# Altium schematic sheet SatelliteDevBoard.SchDoc: SatelliteDevBoard
size 273 x 204 mm; Origin: Eagle; OriginPath: C:\Users\New User\OneDrive - Georgia Institute of Technology\Documents\iridium-satellite-comm\SatelliteDevBoard.sch; OriginSheet: 1; Date: 10/23/2025 6:23:18 PM; SheetNumber: 1; GateName_1: G$1; SymbolName_1: LETTER_L; LibraryName: frames; DeviceSetName: LETTER_L; GateName_2: G$2; SymbolName_2: DOCFIELD; Sheet: Sheet:; REV: REV:
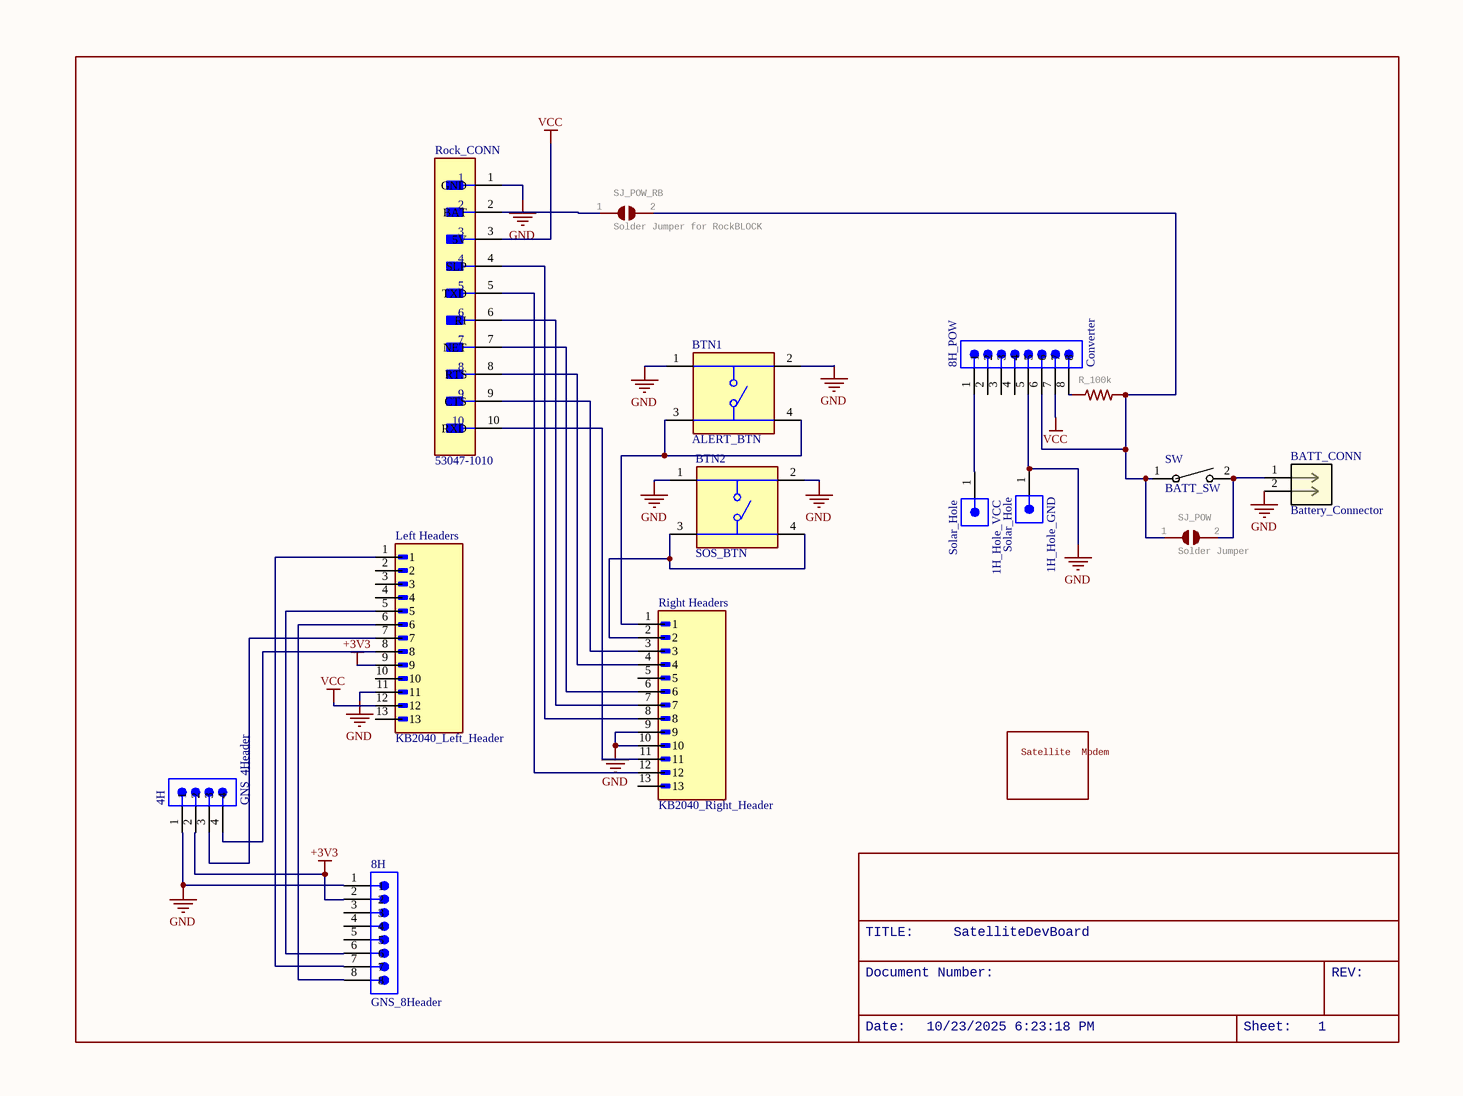
[diagram p0: SatelliteDevBoard.SchDoc]

## Parts
1H_Hole_GND  Solar_Hole  [61300111121]
1H_Hole_VCC  Solar_Hole  [61300111121]
4H  GNS_4Header  [61300411121]
8H  GNS_8Header  [61300811121]
8H_POW  Converter  [61300811121]
BATT_CONN  Battery_Connector  [CONN_S2B-PH-K-S_JST]
BTN1  ALERT_BTN  [SW_TS02-66-43-BK-260-LCR-D]
BTN2  SOS_BTN  [SW_TS02-66-43-BK-260-LCR-D]
Left_Headers  KB2040_Left_Header  [HARWIN_M20-9991346]
R_100k  (no value)  [0805-THM]
Right_Headers  KB2040_Right_Header  [HARWIN_M20-9991346]
Rock_CONN  53047-1010  [FP-53047-1010-MFG]
SJ_POW  Solder Jumper  [SOLDERJUMPER_ARROW_NOPASTE]
SJ_POW_RB  Solder Jumper for RockBLOCK  [SOLDERJUMPER_ARROW_NOPASTE]
SW  BATT_SW  [SW2_GF-123-0054_CWI]
U$1  Satellite
Modem: Satellite / Modem  [ROCKBLOCK-9603]  (hidden comment: ROCKBLOCK-9603)

## Nets
+3V3: 4H.2 8H.2 Left_Headers.9
GND: 1H_Hole_GND.1 4H.1 8H.1 8H_POW.5 BATT_CONN.2 BTN1.1 BTN1.2 BTN2.1 BTN2.2 Left_Headers.11 Right_Headers.9 Right_Headers.10 Rock_CONN.1(GND)
VCC: 8H_POW.7 Left_Headers.12 Rock_CONN.3(5V)
Net1H_Hole_VCC_1: 1H_Hole_VCC.1 8H_POW.1
Net4H_3: 4H.3 Left_Headers.7
Net4H_4: 4H.4 Left_Headers.8
Net8H_6: 8H.6 Left_Headers.5
Net8H_7: 8H.7 Left_Headers.1
Net8H_8: 8H.8 Left_Headers.6
Net8H_POW_6: 8H_POW.6 R_100k.2 SJ_POW.1 SJ_POW_RB.2 SW.1
Net8H_POW_8: 8H_POW.8 R_100k.1
NetBATT_CONN_1: BATT_CONN.1 SJ_POW.2 SW.2
NetBTN1_3: BTN1.3 BTN1.4 Right_Headers.1
NetBTN2_3: BTN2.3 BTN2.4 Right_Headers.2
NetRight_Headers_3: Right_Headers.3 Rock_CONN.9(CTS)
NetRight_Headers_4: Right_Headers.4 Rock_CONN.8(RTS)
NetRight_Headers_6: Right_Headers.6 Rock_CONN.7(NET)
NetRight_Headers_7: Right_Headers.7 Rock_CONN.6(RI)
NetRight_Headers_8: Right_Headers.8 Rock_CONN.4(SLP)
NetRight_Headers_11: Right_Headers.11 Rock_CONN.10(RXD)
NetRight_Headers_12: Right_Headers.12 Rock_CONN.5(TXD)
NetRock_CONN_2: Rock_CONN.2(BAT) SJ_POW_RB.1

Not connected (* = marked no-connect by the designer): 8H 3 4 5; 8H_POW 2 3 4; Left_Headers 2 3 4 10 13; Right_Headers 5 13

## Notes on the sheet
- TITLE:
- Document Number:
- SatelliteDevBoard
- REV:
- Date:
- 10/23/2025 6:23:18 PM
- Sheet:
- 1

## Library data of the parts
1H_Hole_GND 1H_Hole_VCC = CMP-1502-01058-4: THT Vertical Pin Header WR-PHD, Pitch 2.54 mm, Single Row, 1 pins; Gender: Male; Contact Resistance: 20mΩ; Current Rating: 3A; Number of Contacts: 1; Connector Type: Male Pin; Operating Supply Voltage: 250V; Termination: Solder; Mount: Through Hole; Orientation: Vertical; Contact Material: Copper; Number of Positions: 1; Color: Black; Packaging: Bulk; Contact Plating: Gold; Number of Pins: 1; Contact Mating Length: 5.9944mm; RoHS: Compliant; Number of Rows: 1; Lead Pitch: 2.54mm
4H = CMP-1502-01064-4: THT Vertical Pin Header WR-PHD, Pitch 2.54 mm, Single Row, 4 pins; Connector Type: Male Pin; Gender: Male; Current Rating: 3A; Number of Positions: 4; Operating Supply Voltage: 250V; Contact Resistance: 20mΩ; Pitch: 2.54mm; Max Operating Temperature: 105°C; Mount: Through Hole; Contact Material: Gold; Contact Plating: Gold; Number of Contacts: 4; Orientation: Vertical; Packaging: Bulk; Contact Mating Length: 5.9944mm; Voltage Rating: 250V; Number of Rows: 1; Height: 8.89mm; Lead Free: Lead Free; Lead Pitch: 2.54mm; Number of Pins: 4; Color: Black; Min Operating Temperature: -40°C; RoHS: Compliant; Termination: Solder
8H 8H_POW = CMP-1502-01076-4: THT Vertical Pin Header WR-PHD, Pitch 2.54 mm, Single Row, 8 pins; Pitch: 2.54mm; Voltage Rating: 250V; Connector Type: Male Pin; Current Rating: 3A; Contact Resistance: 20mΩ; Number of Positions: 8; Gender: Male; Contact Mating Length: 5.9944mm; Orientation: Vertical; Contact Plating: Gold; Mount: Through Hole; Min Operating Temperature: -40°C; Packaging: Bulk; Height: 8.54mm; Number of Pins: 8; Contact Material: Gold; Operating Supply Voltage: 250V; Termination: Solder; RoHS: Compliant; Color: Black; Number of Contacts: 8; Lead Pitch: 2.54mm; Number of Rows: 1; Max Operating Temperature: 105°C
BATT_CONN = S2B-PH-K-SLFSN: CONNECTOR; MALE; THROUGH HOLE; 2.0MM PITCH; DISCONNECTABLE CRIMP STYLE CONNECTOR; SIDE ENTRY TYPE; RIGHT ANGLE; 2PINS; Manufacturer_Name: JST; Manufacturer_Part_Number: S2B-PH-K-S(LF)(SN); Copyright: Copyright (C) 2025 Ultra Librarian. All rights reserved.; RefDes: RefDes; Type: Type
BTN1 BTN2 = TS02-66-43-BK-260-LCR-D: 6 x 6 mm, 4.3 mm Actuator Height, 260 gf, Black, Long Crimped, Through Hole, SPST, Tactile Switch; MF: Same Sky; SnapEDA_Link: https://www.snapeda.com/parts/TS02-66-43-BK-260-LCR-D/Same+Sky/view-part/?ref=snap; Package: None; Value: *; MP: TS02-66-43-BK-260-LCR-D; Check_prices: https://www.snapeda.com/parts/TS02-66-43-BK-260-LCR-D/Same+Sky/view-part/?ref=eda
Left_Headers Right_Headers = M20-9991346: Package: None; Price: None; Value: *; MP: M20-9991346; Availability: Unavailable
R_100k = RESISTOR_DUAL: GateName_1: G$1; SymbolName_1: R-US; LibraryName: microbuilder; DeviceSetName: RESISTOR_DUAL; Package: 0805-THM
Rock_CONN = CMP-04776-000170-1: CONN HEADER VERT 10POS 1.25MM; Working Voltage: 125V; Insulation Resistance: 100MR; Number of Contacts: 10; Max Voltage Rating (DC): 125.125kV; Glow Wire Compliant: Non-compliant; Current: 1A; Plating: Tin; Contact Resistance: 20MR; Pitch: 1.25mm; Voltage: 125V; Min Operating Temperature: -40°C; Mount: Through Hole; Contact Plating: Tin; Voltage Rating (DC): 125V; Contact Material: Bronze; Lead Free: Lead Free; Voltage Rating (AC): 125V; Length: 14.25mm; Number of Poles: 10; Max Voltage Rating (AC): 125V; Orientation: Vertical; Series: PicoBlade; Voltage Rating: 125V; Color: Natural; Contact Gender: Male; Number of Rows: 1; Package Quantity: 2000; Number of Circuits: 10; RoHS Compliant: Yes; Termination: Solder; Housing Material: Nylon; Flammability Rating: UL94 V-0; Number of Positions: 10; Body Plating: Tin; Packaging: Tray; Current Rating: 1A; Max Operating Temperature: 85°C; Height: 4.2mm; Max Current Rating: 1A; Depth: 3.2mm; Lead Pitch: 1.25mm; Radiation Hardening: No; Housing Color: White
SJ_POW SJ_POW_RB = SOLDERJUMPER: GateName_1: 1; BOM: EXCLUDE; SymbolName_1: SOLDERJUMPER; LibraryName: microbuilder; DeviceSetName: SOLDERJUMPER; Package: SOLDERJUMPER_ARROW_NOPASTE
SW = GF-123-0054: Description; Manufacturer_Name: CW Industries; Copyright: Copyright (C) 2025 Ultra Librarian. All rights reserved.; Manufacturer_Part_Number: GF-123-0054
U$1 = ROCKBLOCK-9603: GateName_1: G$1; SymbolName_1: SATMODEM; LibraryName: nootropicdesign; DeviceSetName: ROCKBLOCK-9603